# EAGLE design LogicBlocks-splitter (EAGLE 6.2)
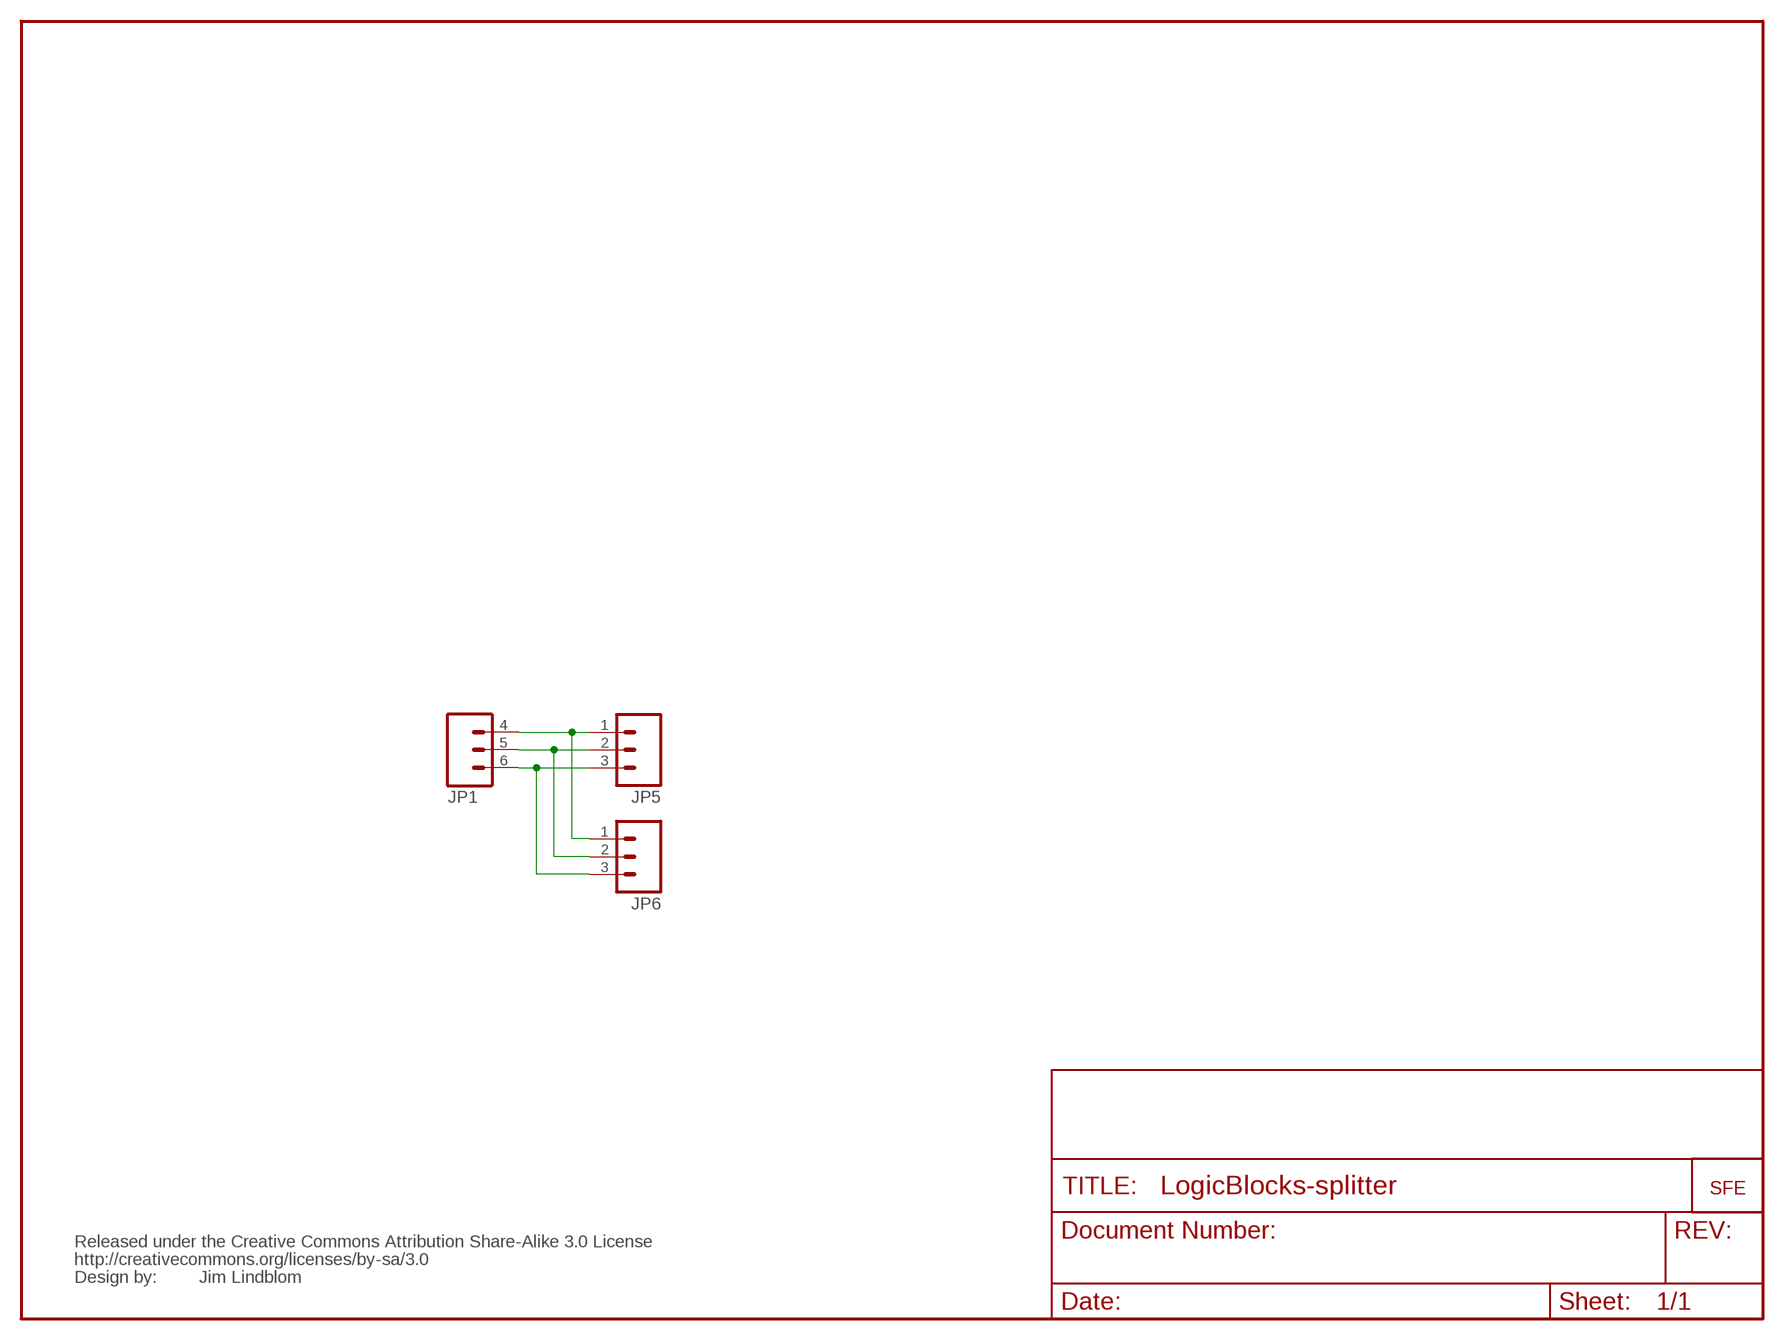
[diagram p0: schematic, sheet 1]

## Parts
JP1  M03SMD-RA-FEMALE  [1X03-SMD-FEMALE]
JP4  LOGO-SFESK  [SFE-LOGO-FLAME]
JP5  M03SMD_RA_MALE_POST  [1X03_SMD_RA_MALE_POST]
JP6  M03SMD_RA_MALE_POST  [1X03_SMD_RA_MALE_POST]
U$1  CREATIVE_COMMONS  [CREATIVE_COMMONS]

## Nets
GND: JP1.6 JP5.3 JP6.3
S: JP1.5 JP5.2 JP6.2
VCC: JP1.4 JP5.1 JP6.1

## Notes on the sheet
- Jim Lindblom

## Library data of the parts
JP1 = SparkFun:M03: Header 3 Standard 3-pin 0.1" header. Use with straight break away headers (SKU : PRT-00116), right angle break away headers (PRT-00553), swiss pins (PRT-00743), machine pins (PRT-00117), and female headers (PRT-00115). Molex polarized connector foot print use with SKU : PRT-08232 with associated crimp pins and housings.
JP4 = SparkFun:LOGO-SFE: Spark Fun Electronics PCB Logo This is the standard Spark Fun Electronics PCB logo.
JP5 JP6 = SparkFun-Connectors:M03: Header 3 Standard 3-pin 0.1" header. Use with straight break away headers (SKU : PRT-00116), right angle break away headers (PRT-00553), swiss pins (PRT-00743), machine pins (PRT-00117), and female headers (PRT-00115). Molex polarized connector foot print use with SKU : PRT-08232 with associated crimp pins and housings.
U$1 = SparkFun:CREATIVE_COMMONS

## Board
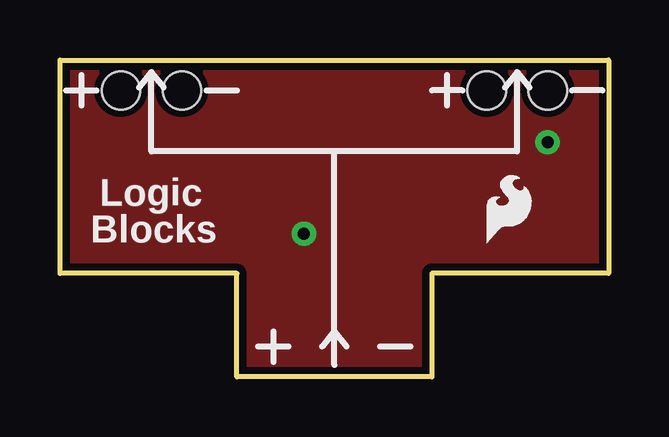
[diagram p1: board, top side]
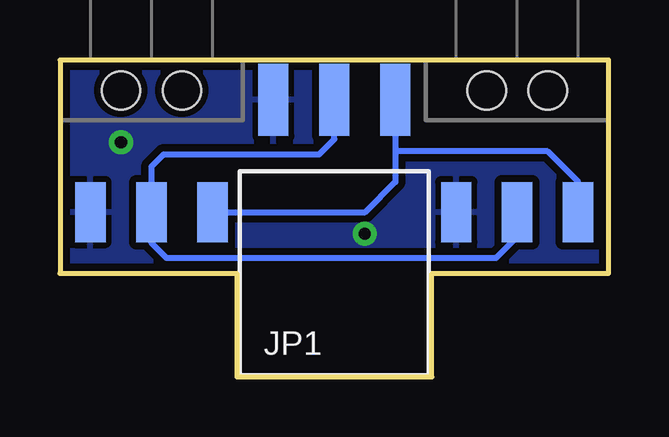
[diagram p2: board, bottom side, seen from below]

Size 22.86 x 13.21 mm. Coordinates in mm from the lower left corner, seen from the top.
Outline: 7.37,0 7.37,4.32 0,4.32 0,13.21 22.86,13.21 22.86,4.32 15.49,4.32 15.49,0 7.37,0
Copper layers (1*16): Top 0.035mm / dielectric 1.5mm / Bottom 0.035mm
Design rules: minimum track width 8mil, minimum drill 20mil, track to track 8mil, track to pad 8mil, pad to pad 8mil, via to via 8mil, smd to smd 8mil, copper to edge 8mil, drill to drill 8mil, minimum pad ring 12mil, minimum via ring 10mil, stop-mask expansion 4mil, vias tented up to drill 20mil, thermal gap 10mil

### Footprints (pad centres in the part's own frame; a part is rotated, then mirrored left to right if it is on the bottom)
1X03-SMD-FEMALE = smd 1.25 x 3: 4 2.54,7.225; 5 0,7.225; 6 -2.54,7.225
1X03_SMD_RA_MALE_POST = smd 1.27 x 2.5: 1 -2.54,5.07; 2 0,5.07; 3 2.54,5.07 | hole 1.6: -1.27,0; 1.27,0

### Placement (x,y rotation side)
JP1  11.43,4.32 0 bottom
JP4  17.78,5.59 0 top
JP5  19.05,11.94 180 bottom
JP6  3.81,11.94 180 bottom
U$1  20.32,-14.73 0 top  (outside the outline)

### Tracks (layer width: path | path; a pad name or v marks a point on that pad's centre or on a via)
GND  (via drill 0.51)
  other vias: 10.16,5.97 20.32,9.78
  pour Bottom (isolate 0.305): 0,13.21 0,4.32 7.37,4.32 7.37,0 15.49,0 15.49,4.32 22.86,4.32 22.86,13.21
  pour Top (isolate 0.305): 0,13.21 0,4.32 7.37,4.32 7.37,0 15.49,0 15.49,4.32 22.86,4.32 22.86,13.21
S
  Bottom 0.254: JP1.5 11.43,9.91 12.06,9.27 18.54,9.27 19.05,8.76 JP5.2 19.05,5.59 18.41,4.95 4.7,4.95 3.81,5.84 JP6.2
VCC
  Bottom 0.254: JP1.4 8.89,9.4 | 8.89,9.4 8.89,8.13 10.15,6.87 JP5.1 | JP6.1 1.27,8.13 2.54,9.4 8.89,9.4

### Text on the board
tPlace: Logic | Blocks